# EAGLE design 3v3_power (EAGLE 9.3.0)
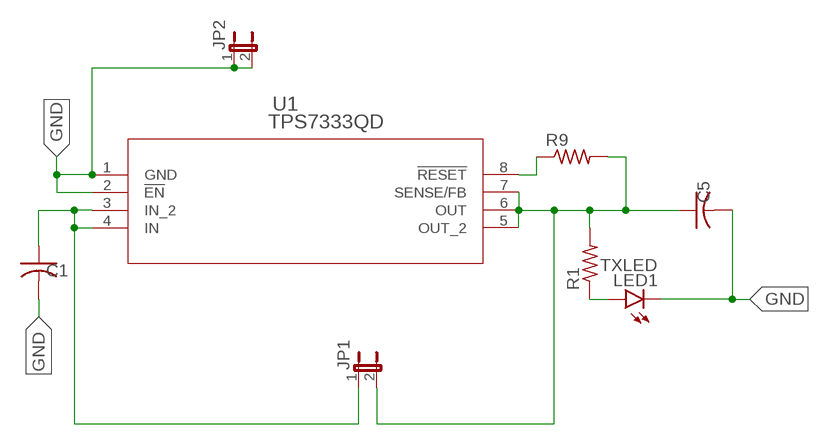
[diagram p0: schematic, sheet 1]

## Parts
C1  C-USC1206  [C1206]
C5  C-USC1206  [C1206]
JP1  JP1E  [JP1]
JP2  JP1E  [JP1]
LED1  TXLED  LEDCHIPLED_1206  [CHIPLED_1206]
R1  R-US_R1206  [R1206]
R9  R-US_R1206  [R1206]
U1  TPS7333QD  [D8]

## Nets
GND: C1.2 C5.2 JP2.1 JP2.2 LED1.C U1.1(GND) U1.2(!EN)
N$2: C1.1 JP1.1 U1.3(IN_2) U1.4(IN)
N$3: C5.1 JP1.2 R1.2 R9.2 U1.5(OUT_2) U1.6(OUT) U1.7(SENSE/FB)
N$4: R9.1 U1.8(!RESET)
N$5: LED1.A R1.1

## Library data of the parts
C1 C5 = rcl:C-US: CAPACITOR, American symbol; SPICEPREFIX: C
JP1 JP2 = jumper:JP1E: JUMPER
LED1 = led:LED: LED OSRAM: - CHIPLED LG R971, LG N971, LY N971, LG Q971, LY Q971, LO R971, LY R971 LH N974, LH R974 LS Q976, LO Q976, LY Q976 LO Q996 - Hyper CHIPLED LW Q18S LB Q993, LB Q99A, LB R99A - SideLED LS A670, LO A670, LY A670, LG A670, LP A670 LB A673, LV A673, LT A673, LW A673 LH A674 LY A675 LS A676, LA A676, LO A676, LY A676, LW A676 LS A679, LY A679, LG A679 - Hyper Micro SIDELED® LS Y876, LA Y876, LO Y876, LY Y876 LT Y87S - SmartLED LW L88C, LW L88S LB L89C, LB L89S, LG L890 LS L89K, LO L89K, LY L89K LS L896, LA L896, LO L896, LY L896 - TOPLED LS T670, LO T670, LY T670, LG T670, LP T670 LSG T670, LSP T670, LSY T670, LOP T670, LYG T670 LG T671, LOG T671, LSG T671 LB T673, LV T673, LT T673, LW T673 LH T674 LS T676, LA T676, LO T676, LY T676, LB T676, LH T676, LSB T676, LW T676 LB T67C, LV T67C, LT T67C, LS T67K, LO T67K, LY T67K, LW E67C LS E67B, LA E67B, LO E67B, LY E67B, LB E67C, LV E67C, LT E67C LW T67C LS T679, LY T679, LG T679 LS T770, LO T770, LY T770, LG T770, LP T770 LB T773, LV T773, LT T773, LW T773 LH T774 LS E675, LA E675, LY E675, LS T675 LS T776, LA T776, LO T776, LY T776, LB T776 LHGB T686 LT T68C, LB T68C - Hyper Mini TOPLED® LB M676 - Mini TOPLED Santana® LG M470 LS M47K, LO M47K, LY M47K Source: http://www.osram.convergy.de LUXEON: - LUMILED® LXK2-PW12-R00, LXK2-PW12-S00, LXK2-PW14-U00, LXK2-PW14-V00 LXK2-PM12-R00, LXK2-PM12-S00, LXK2-PM14-U00 LXK2-PE12-Q00, LXK2-PE12-R00, LXK2-PE12-S00, LXK2-PE14-T00, LXK2-PE14-U00 LXK2-PB12-K00, LXK2-PB12-L00, LXK2-PB12-M00, LXK2-PB14-N00, LXK2-PB14-P00, LXK2-PB14-Q00 LXK2-PR12-L00, LXK2-PR12-M00, LXK2-PR14-Q00, LXK2-PR14-R00 LXK2-PD12-Q00, LXK2-PD12-R00, LXK2-PD12-S00 LXK2-PH12-R00, LXK2-PH12-S00 LXK2-PL12-P00, LXK2-PL12-Q00, LXK2-PL12-R00 Source: www.luxeon.com KINGBRIGHT: KA-3528ASYC Source: www.kingbright.com
R1 R9 = rcl:R-US_: RESISTOR, American symbol; SPICEPREFIX: R
U1 = TPS7333:TPS7333QD; MANUFACTURER_PART_NUMBER: TPS7333QD; VENDOR: Texas Instruments

## Board
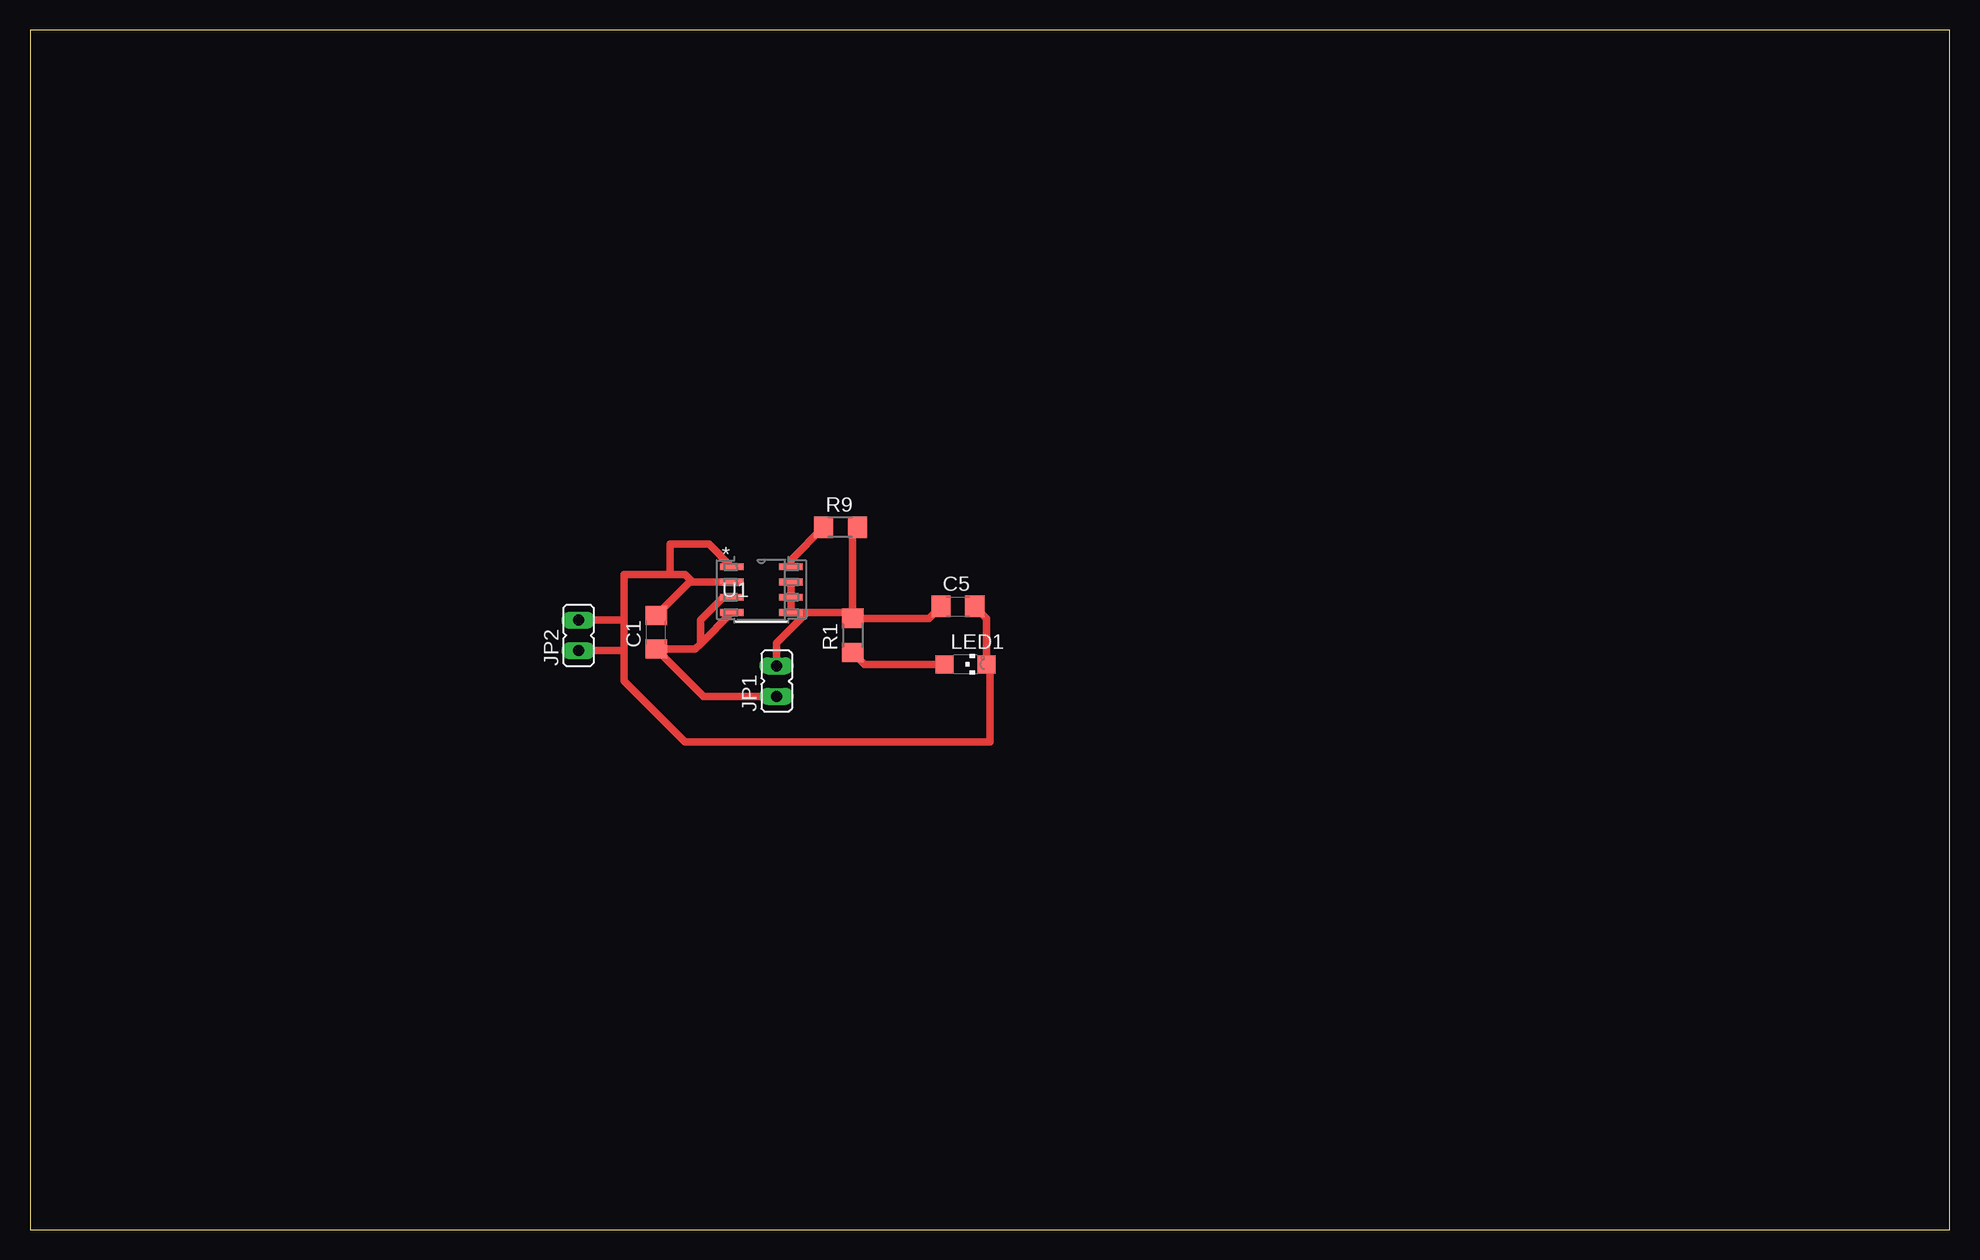
[diagram p1: board, top side]

Size 160 x 100 mm. Coordinates in mm from the lower left corner, seen from the top.
Outline: 0,0 160,0 160,100 0,100 0,0
Copper layers (1*16): Top 0.035mm / dielectric 1.5mm / Bottom 0.035mm
Design rules "default *": minimum track width 6mil, minimum drill 0.35mm, track to track 26mil, track to pad 26mil, pad to pad 26mil, via to via 26mil, smd to smd 26mil, copper to edge 40mil, drill to drill 6mil, minimum pad ring 10mil, minimum via ring 8mil, stop-mask expansion 4mil, vias tented up to drill 0mil, thermal gap 10mil

### Footprints (pad centres in the part's own frame; a part is rotated, then mirrored left to right if it is on the bottom)
C1206 = smd 1.6 x 1.8: 1 -1.4,0; 2 1.4,0
JP1 = drill 0.914 long: 1 0,-1.27; 2 0,1.27
CHIPLED_1206 = smd 1.5 x 1.5: A 0,-1.75; C 0,1.75
R1206 = smd 1.6 x 1.803: 1 -1.422,0; 2 1.422,0
D8 = smd 1.981 x 0.559: 1 -2.464,1.905; 2 -2.464,0.635; 3 -2.464,-0.635; 4 -2.464,-1.905; 5 2.464,-1.905; 6 2.464,-0.635; 7 2.464,0.635; 8 2.464,1.905

### Placement (x,y rotation side)
C1  52.2,49.78 90 top
C5  77.34,51.94 0 top
JP1  62.23,45.72 0 top
JP2  45.72,49.53 0 top
LED1  77.98,47.12 270 top
R1  68.58,49.53 90 top
R9  67.56,58.55 0 top
U1  60.96,53.34 0 top

### Tracks (layer width: path | path; a pad name or v marks a point on that pad's centre or on a via)
GND
  Top 0.61: U1.1 56.59,57.15 53.34,57.15 53.34,54.61 | 55.24,53.98 U1.2 | C1.2 55.12,54.1 54.61,54.61 53.34,54.61 | C5.2 79.73,50.96 LED1.C 80.01,46.84 80.01,40.64 54.61,40.64 49.53,45.72 49.53,48.26 | 53.34,54.61 49.53,54.61 49.53,50.8 | 49.53,50.8 49.53,48.26 | JP2.2 49.53,50.8 | JP2.1 49.53,48.26
N$2
  Top 0.61: U1.4 55.88,48.82 | U1.3 57.78,52.7 55.88,50.8 55.88,48.82 | 55.88,48.82 55.45,48.38 C1.1 56.13,44.45 JP1.1
N$3
  Top 0.61: R1.2 74.95,50.95 C5.1 | 64.77,51.44 U1.5 U1.6 U1.7 | 64.77,51.44 68.1,51.44 R1.2 | R9.2 68.58,58.14 R1.2 | JP1.2 62.23,48.9 64.77,51.44
N$4
  Top 0.61: U1.8 63.42,55.83 R9.1
N$5
  Top 0.61: LED1.A 69.57,47.12 R1.1